# EAGLE design openmv (EAGLE 6.1)
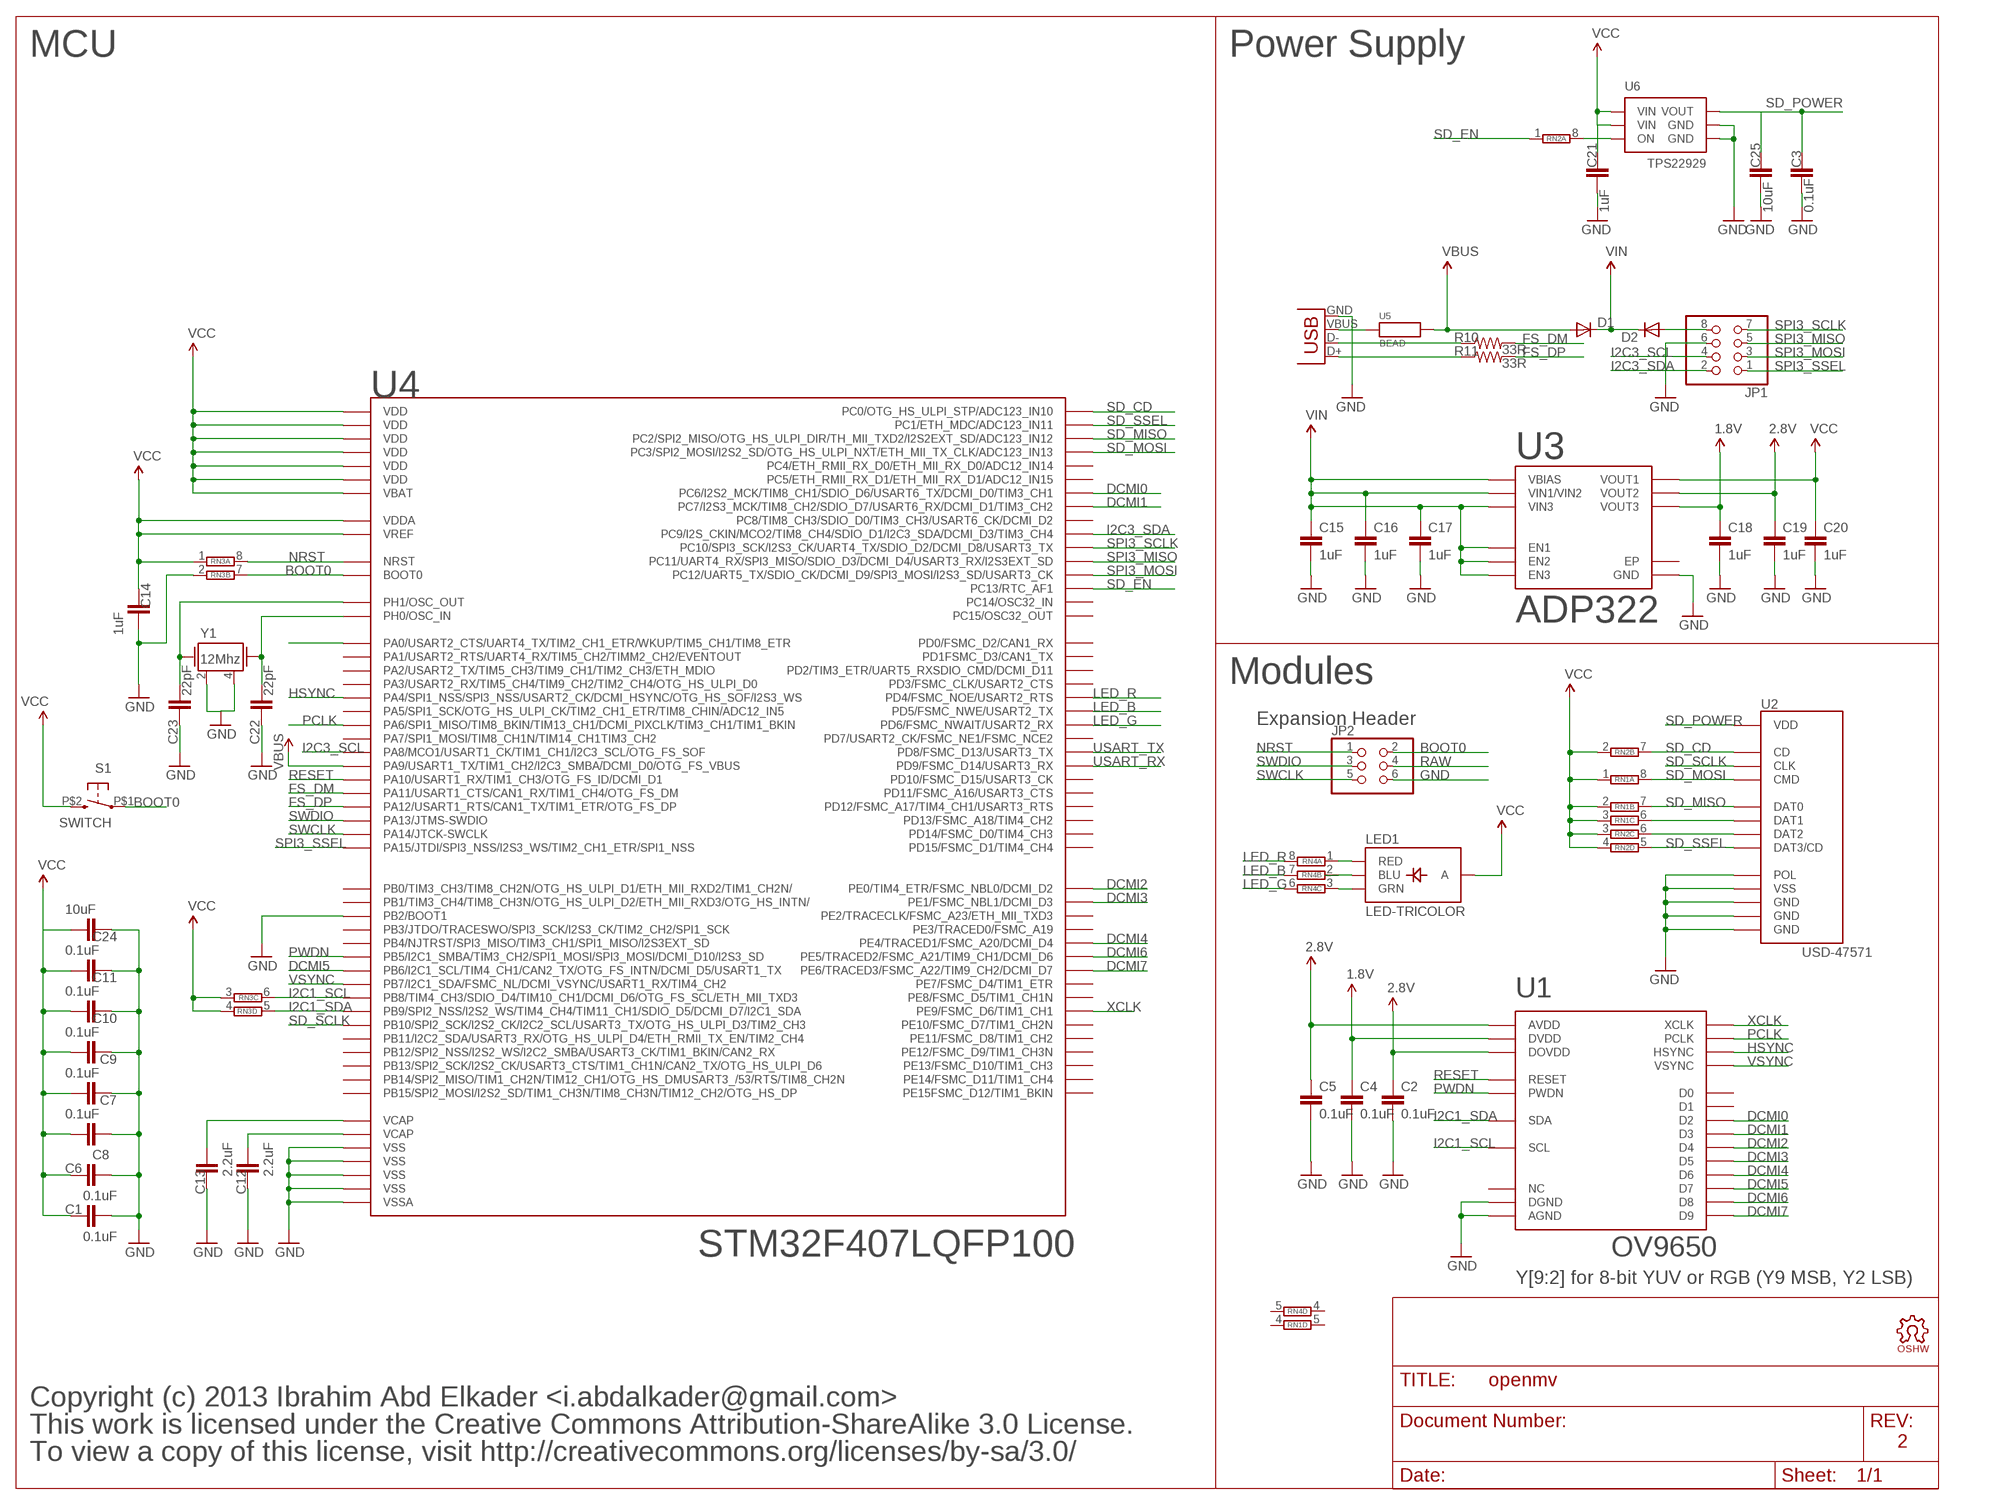
[diagram p0: schematic, sheet 1]

## Parts
C1  0.1uF  CAP0402-CAP  [0402-CAP]
C2  0.1uF  CAP0402-CAP  [0402-CAP]
C3  0.1uF  CAP0402-CAP  [0402-CAP]
C4  0.1uF  CAP0402-CAP  [0402-CAP]
C5  0.1uF  CAP0402-CAP  [0402-CAP]
C6  0.1uF  CAP0402-CAP  [0402-CAP]
C7  0.1uF  CAP0402-CAP  [0402-CAP]
C8  0.1uF  CAP0402-CAP  [0402-CAP]
C9  0.1uF  CAP0402-CAP  [0402-CAP]
C10  0.1uF  CAP0402-CAP  [0402-CAP]
C11  0.1uF  CAP0402-CAP  [0402-CAP]
C12  2.2uF  CAP0402-CAP  [0402-CAP]
C13  2.2uF  CAP0402-CAP  [0402-CAP]
C14  1uF  CAP0402-CAP  [0402-CAP]
C15  1uF  CAP0402-CAP  [0402-CAP]
C16  1uF  CAP0402-CAP  [0402-CAP]
C17  1uF  CAP0402-CAP  [0402-CAP]
C18  1uF  CAP0402-CAP  [0402-CAP]
C19  1uF  CAP0402-CAP  [0402-CAP]
C20  1uF  CAP0402-CAP  [0402-CAP]
C21  1uF  CAP0402-CAP  [0402-CAP]
C22  22pF  CAP0402-CAP  [0402-CAP]
C23  22pF  CAP0402-CAP  [0402-CAP]
C24  10uF  CAP0805  [0805]
C25  10uF  CAP0805  [0805]
D1  DIODESOD  [SOD-323]
D2  DIODESOD  [SOD-323]
JP1  PINHD-2X4  [2X04]
JP2  PINHD-2X3  [2X03]
LED1  LED-TRICOLOR  [LED-TRICOLOR-SMD]
LOGO1  OSHW_LOGO_FILLX0150-NT  [OSHW_FILLX150_NOTEXT]
R10  33R  RESISTOR0402-RES  [0402-RES]
R11  33R  RESISTOR0402-RES  [0402-RES]
RN1  4R-NCAT16  [CAT16]
RN2  4R-NCAT16  [CAT16]
RN3  4R-NCAT16  [CAT16]
RN4  4R-NCAT16  [CAT16]
S1  SWITCH  [B3U-1000P]
U1  OV9650  [OV9650]
U2  USD-47571  [USD-47571]
U3  ADP322  [WFQFN-16]
U4  STM32F407LQFP100  [LQFP100]
U5  BEAD  [0402-CAP]
U6  TPS22929  [SOT23-6]
X1  USB-MICROB  [USB-MICROB]
Y1  12Mhz  CRYSTAL5X3  [CRYSTAL-SMD-5X3]

## Nets
1.8V: C4.1 C18.1 U1.P$10(DVDD) U3.8(VOUT3)
2.8V: C2.1 C5.1 C19.1 U1.P$4(AVDD) U1.P$11(DOVDD) U3.6(VOUT2)
BOOT0: JP2.2 RN3.7 S1.P$1 U4.94(BOOT0)
DCMI0: U1.P$19(D2) U4.63(PC6/I2S2_MCK/TIM8_CH1/SDIO_D6/USART6_TX/DCMI_D0/TIM3_CH1)
DCMI1: U1.P$21(D3) U4.64(PC7/I2S3_MCK/TIM8_CH2/SDIO_D7/USART6_RX/DCMI_D1/TIM3_CH2)
DCMI2: U1.P$22(D4) U4.97(PE0/TIM4_ETR/FSMC_NBL0/DCMI_D2)
DCMI3: U1.P$20(D5) U4.98(PE1/FSMC_NBL1/DCMI_D3)
DCMI4: U1.P$18(D6) U4.3(PE4/TRACED1/FSMC_A20/DCMI_D4)
DCMI5: U1.P$16(D7) U4.92(PB6/I2C1_SCL/TIM4_CH1/CAN2_TX/OTG_FS_INTN/DCMI_D5/USART1_TX)
DCMI6: U1.P$14(D8) U4.4(PE5/TRACED2/FSMC_A21/TIM9_CH1/DCMI_D6)
DCMI7: U1.P$12(D9) U4.5(PE6/TRACED3/FSMC_A22/TIM9_CH2/DCMI_D7)
FS_DM: R10.2 U4.70(PA11/USART1_CTS/CAN1_RX/TIM1_CH4/OTG_FS_DM)
FS_DP: R11.2 U4.71(PA12/USART1_RTS/CAN1_TX/TIM1_ETR/OTG_FS_DP)
GND: C1.1 C2.2 C3.2 C4.2 C5.2 C6.1 C7.2 C8.1 C9.2 C10.2 C11.2 C12.2 C13.2 C14.1 C15.2 C16.2 C17.2 C18.2 C19.2 C20.2 C21.2 C22.2 C23.2 C24.1 C25.2 JP1.6 JP2.6 RN3.2 U1.P$2(AGND) U1.P$15(DGND) U2.G$1(GND) U2.G$2(GND) U2.G$3(GND) U2.G$4(POL) U2.P$6(VSS) U3.12(GND) U4.10(VSS) U4.20(VSSA) U4.27(VSS) U4.37(PB2/BOOT1) U4.74(VSS) U4.99(VSS) U6.2(GND) U6.5(GND) X1.GND Y1.2 Y1.4
HSYNC: U1.P$9(HSYNC) U4.29(PA4/SPI1_NSS/SPI3_NSS/USART2_CK/DCMI_HSYNC/OTG_HS_SOF/I2S3_WS)
I2C1_SCL: RN3.6 U1.P$5(SCL) U4.95(PB8/TIM4_CH3/SDIO_D4/TIM10_CH1/DCMI_D6/OTG_FS_SCL/ETH_MII_TXD3)
I2C1_SDA: RN3.5 U1.P$3(SDA) U4.96(PB9/SPI2_NSS/I2S2_WS/TIM4_CH4/TIM11_CH1/SDIO_D5/DCMI_D7/I2C1_SDA)
I2C3_SCL: JP1.4 U4.67(PA8/MCO1/USART1_CK/TIM1_CH1/I2C3_SCL/OTG_FS_SOF)
I2C3_SDA: JP1.2 U4.66(PC9/I2S_CKIN/MCO2/TIM8_CH4/SDIO_D1/I2C3_SDA/DCMI_D3/TIM3_CH4)
LED_B: RN4.7 U4.86(PD5/FSMC_NWE/USART2_TX)
LED_G: RN4.6 U4.87(PD6/FSMC_NWAIT/USART2_RX)
LED_R: RN4.8 U4.85(PD4/FSMC_NOE/USART2_RTS)
N$1: RN1.6 U2.P$8(DAT1)
N$2: RN2.6 U2.P$1(DAT2)
N$3: LED1.R(RED) RN4.1
N$4: LED1.B(BLU) RN4.2
N$5: LED1.G(GRN) RN4.3
N$6: U4.23(PA0/USART2_CTS/UART4_TX/TIM2_CH1_ETR/WKUP/TIM5_CH1/TIM8_ETR)
N$8: RN2.8 U6.3(ON)
N$9: C23.1 U4.13(PH1/OSC_OUT) Y1.1
N$10: C22.1 U4.12(PH0/OSC_IN) Y1.3
N$20: R10.1 X1.D-
N$21: R11.1 X1.D+
N$22: U5.1 X1.VBUS
NRST: JP2.1 RN3.8 U4.14(NRST)
PCLK: U1.P$17(PCLK) U4.31(PA6/SPI1_MISO/TIM8_BKIN/TIM13_CH1/DCMI_PIXCLK/TIM3_CH1/TIM1_BKIN)
PWDN: U1.P$8(PWDN) U4.91(PB5/I2C1_SMBA/TIM3_CH2/SPI1_MOSI/SPI3_MOSI/DCMI_D10/I2S3_SD)
RAW: D2.2(A) JP1.8 JP2.4
RESET: U1.P$6(RESET) U4.69(PA10/USART1_RX/TIM1_CH3/OTG_FS_ID/DCMI_D1)
SD_CD: RN2.7 U2.G$5(CD) U4.15(PC0/OTG_HS_ULPI_STP/ADC123_IN10)
SD_EN: RN2.1 U4.7(PC13/RTC_AF1)
SD_MISO: RN1.7 U2.P$7(DAT0) U4.17(PC2/SPI2_MISO/OTG_HS_ULPI_DIR/TH_MII_TXD2/I2S2EXT_SD/ADC123_IN12)
SD_MOSI: RN1.8 U2.P$3(CMD) U4.18(PC3/SPI2_MOSI/I2S2_SD/OTG_HS_ULPI_NXT/ETH_MII_TX_CLK/ADC123_IN13)
SD_POWER: C3.1 C25.1 U2.P$4(VDD) U6.1(VOUT)
SD_SCLK: U2.P$5(CLK) U4.47(PB10/SPI2_SCK/I2S2_CK/I2C2_SCL/USART3_TX/OTG_HS_ULPI_D3/TIM2_CH3)
SD_SSEL: RN2.5 U2.P$2(DAT3/CD) U4.16(PC1/ETH_MDC/ADC123_IN11)
SPI3_MISO: JP1.5 U4.79(PC11/UART4_RX/SPI3_MISO/SDIO_D3/DCMI_D4/USART3_RX/I2S3EXT_SD)
SPI3_MOSI: JP1.3 U4.80(PC12/UART5_TX/SDIO_CK/DCMI_D9/SPI3_MOSI/I2S3_SD/USART3_CK)
SPI3_SCLK: JP1.7 U4.78(PC10/SPI3_SCK/I2S3_CK/UART4_TX/SDIO_D2/DCMI_D8/USART3_TX)
SPI3_SSEL: JP1.1 U4.77(PA15/JTDI/SPI3_NSS/I2S3_WS/TIM2_CH1_ETR/SPI1_NSS)
SWCLK: JP2.5 U4.76(PA14/JTCK-SWCLK)
SWDIO: JP2.3 U4.72(PA13/JTMS-SWDIO)
USART_RX: U4.56(PD9/FSMC_D14/USART3_RX)
USART_TX: U4.55(PD8/FSMC_D13/USART3_TX)
VBUS: D1.2(A) U4.68(PA9/USART1_TX/TIM1_CH2/I2C3_SMBA/DCMI_D0/OTG_FS_VBUS) U5.2
VCAP1: C13.1 U4.49(VCAP)
VCAP2: C12.1 U4.73(VCAP)
VCC: C1.2 C6.2 C7.1 C8.2 C9.1 C10.1 C11.1 C14.2 C20.1 C21.1 C24.2 LED1.A RN1.1 RN1.2 RN1.3 RN2.2 RN2.3 RN2.4 RN3.1 RN3.3 RN3.4 S1.P$2 U3.5(VOUT1) U4.6(VBAT) U4.11(VDD) U4.19(VDD) U4.21(VREF) U4.22(VDDA) U4.28(VDD) U4.50(VDD) U4.75(VDD) U4.100(VDD) U6.4(VIN) U6.6(VIN)
VIN: C15.1 C16.1 C17.1 D1.1(C) D2.1(C) U3.1(EN1) U3.2(VBIAS) U3.3(VIN1/VIN2) U3.10(VIN3) U3.15(EN3) U3.16(EN2)
VSYNC: U1.P$7(VSYNC) U4.93(PB7/I2C1_SDA/FSMC_NL/DCMI_VSYNC/USART1_RX/TIM4_CH2)
XCLK: U1.P$13(XCLK) U4.40(PE9/FSMC_D6/TIM1_CH1)
Unconnected: RN1.4 RN1.5 RN4.4 RN4.5 U1.P$1(NC) U1.P$23(D1) U1.P$24(D0) U3.4(NC) U3.7(NC) U3.9(NC) U3.11(NC) U3.13(NC) U3.14(NC) U3.EXP(EP) U4.1(PE2/TRACECLK/FSMC_A23/ETH_MII_TXD3) U4.2(PE3/TRACED0/FSMC_A19) U4.8(PC14/OSC32_IN) U4.9(PC15/OSC32_OUT) U4.24(PA1/USART2_RTS/UART4_RX/TIM5_CH2/TIMM2_CH2/EVENTOUT) U4.25(PA2/USART2_TX/TIM5_CH3/TIM9_CH1/TIM2_CH3/ETH_MDIO) U4.26(PA3/USART2_RX/TIM5_CH4/TIM9_CH2/TIM2_CH4/OTG_HS_ULPI_D0) U4.30(PA5/SPI1_SCK/OTG_HS_ULPI_CK/TIM2_CH1_ETR/TIM8_CHIN/ADC12_IN5) U4.32(PA7/SPI1_MOSI/TIM8_CH1N/TIM14_CH1TIM3_CH2) U4.33(PC4/ETH_RMII_RX_D0/ETH_MII_RX_D0/ADC12_IN14) U4.34(PC5/ETH_RMII_RX_D1/ETH_MII_RX_D1/ADC12_IN15) U4.35(PB0/TIM3_CH3/TIM8_CH2N/OTG_HS_ULPI_D1/ETH_MII_RXD2/TIM1_CH2N/) U4.36(PB1/TIM3_CH4/TIM8_CH3N/OTG_HS_ULPI_D2/ETH_MII_RXD3/OTG_HS_INTN/) U4.38(PE7/FSMC_D4/TIM1_ETR) U4.39(PE8/FSMC_D5/TIM1_CH1N) U4.41(PE10/FSMC_D7/TIM1_CH2N) U4.42(PE11/FSMC_D8/TIM1_CH2) U4.43(PE12/FSMC_D9/TIM1_CH3N) U4.44(PE13/FSMC_D10/TIM1_CH3) U4.45(PE14/FSMC_D11/TIM1_CH4) U4.46(PE15FSMC_D12/TIM1_BKIN) U4.48(PB11/I2C2_SDA/USART3_RX/OTG_HS_ULPI_D4/ETH_RMII_TX_EN/TIM2_CH4) U4.51(PB12/SPI2_NSS/I2S2_WS/I2C2_SMBA/USART3_CK/TIM1_BKIN/CAN2_RX) U4.52(PB13/SPI2_SCK/I2S2_CK/USART3_CTS/TIM1_CH1N/CAN2_TX/OTG_HS_ULPI_D6) U4.53(PB14/SPI2_MISO/TIM1_CH2N/TIM12_CH1/OTG_HS_DMUSART3_/53/RTS/TIM8_CH2N) U4.54(PB15/SPI2_MOSI/I2S2_SD/TIM1_CH3N/TIM8_CH3N/TIM12_CH2/OTG_HS_DP) U4.57(PD10/FSMC_D15/USART3_CK) U4.58(PD11/FSMC_A16/USART3_CTS) U4.59(PD12/FSMC_A17/TIM4_CH1/USART3_RTS) U4.60(PD13/FSMC_A18/TIM4_CH2) U4.61(PD14/FSMC_D0/TIM4_CH3) U4.62(PD15/FSMC_D1/TIM4_CH4) U4.65(PC8/TIM8_CH3/SDIO_D0/TIM3_CH3/USART6_CK/DCMI_D2) U4.81(PD0/FSMC_D2/CAN1_RX) U4.82(PD1FSMC_D3/CAN1_TX) U4.83(PD2/TIM3_ETR/UART5_RXSDIO_CMD/DCMI_D11) U4.84(PD3/FSMC_CLK/USART2_CTS) U4.88(PD7/USART2_CK/FSMC_NE1/FSMC_NCE2) U4.89(PB3/JTDO/TRACESWO/SPI3_SCK/I2S3_CK/TIM2_CH2/SPI1_SCK) U4.90(PB4/NJTRST/SPI3_MISO/TIM3_CH1/SPI1_MISO/I2S3EXT_SD)

## Notes on the sheet
- MCU | Power Supply
- Modules
- Expansion Header
- Y[9:2] for 8-bit YUV or RGB (Y9 MSB, Y2 LSB)
- Copyright (c) 2013 Ibrahim Abd Elkader <i.abdalkader@gmail.com>
- This work is licensed under the Creative Commons Attribution-ShareAlike 3.0 License.
- 2
- To view a copy of this license, visit http://creativecommons.org/licenses/by-sa/3.0/

## Library data of the parts
C1-C25 = sfe:CAP: Capacitor Standard 0603 ceramic capacitor, and 0.1" leaded capacitor.
D1 D2 = sfe:DIODE: Diode These are standard reverse protection diodes and small signal diodes. SMA package can handle up to about 1A. SOD-323 can handle about 200mA. What the SOD-323 package when ordering, there are some mfgs out there that are 5-pin packages.
JP1 = pinhead:PINHD-2X4: PIN HEADER
JP2 = mux:PINHD-2X3: PIN HEADER
LED1 = sfe:LED-TRICOLOR: Tri-Color LED SMD Proven layout and schematic for triple color LED in SMD package - common anode. Spark Fun Electronics SKU : COM-07844
LOGO1 = iofault:OSHW_LOGO_FILL
R10 R11 = sfe:RESISTOR: Resistor Basic schematic elements and footprints for 0603, 1206, and PTH resistors.
RN1-RN4 = resistor-dil:4R-N: Array Chip Resistor Source: RS Component / Phycomp; OC_FARNELL: unknown; OC_NEWARK: unknown
S1 = mux:SWITCH
U1 = iofault:OV9650
U2 = mux:USD-47571
U3 = iofault:ADP322
U4 = mux:STM32F407
U5 = heka:BEAD
U6 = mux:TPS22929
X1 = sfe:USB: USB Connectors USB-B-PTH is fully proven SKU : PRT-00139 USB-miniB is fully proven SKU : PRT-00587 USB-A-PCB is untested. USB-A-H is throughly reviewed, but untested. Spark Fun Electronics SKU : PRT-00437 USB-B-SMT is throughly reviewed, but untested. Needs silkscreen touching up. USB-A-S has not been used/tested USB-MB-H has not been used/tested
Y1 = mux:CRYSTAL: Crystals Various standard crystals. Proven footprints. Spark Fun Electronics SKU : COM-00534

## Net classes
0 default: width 0.152 mm

## Board
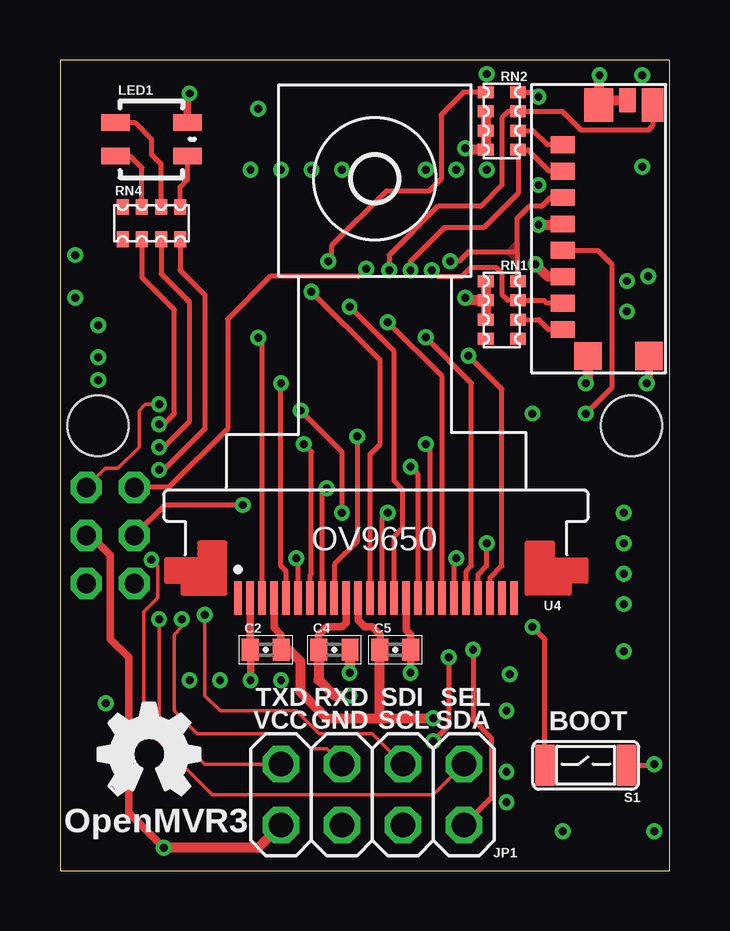
[diagram p1: board, top side]
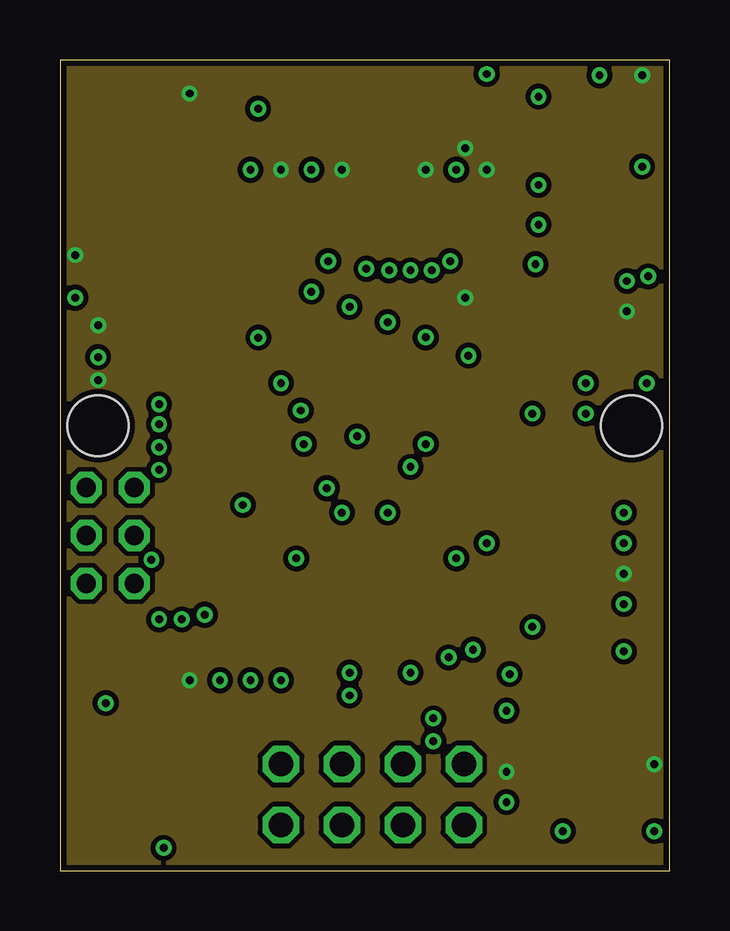
[diagram p2: board, inner layer Route2]
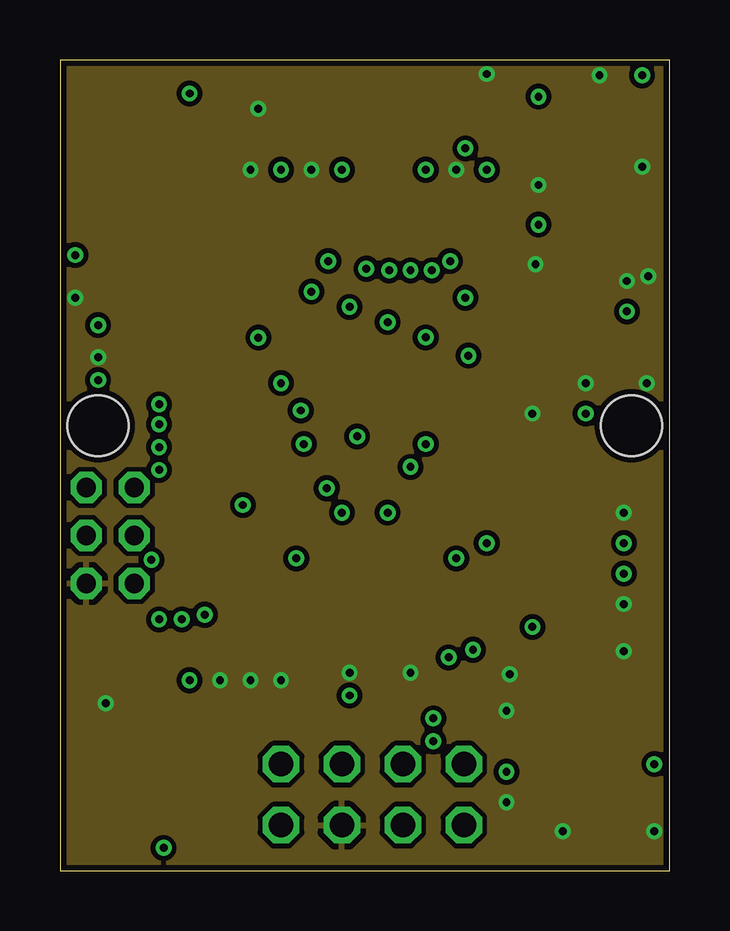
[diagram p3: board, inner layer Route15]
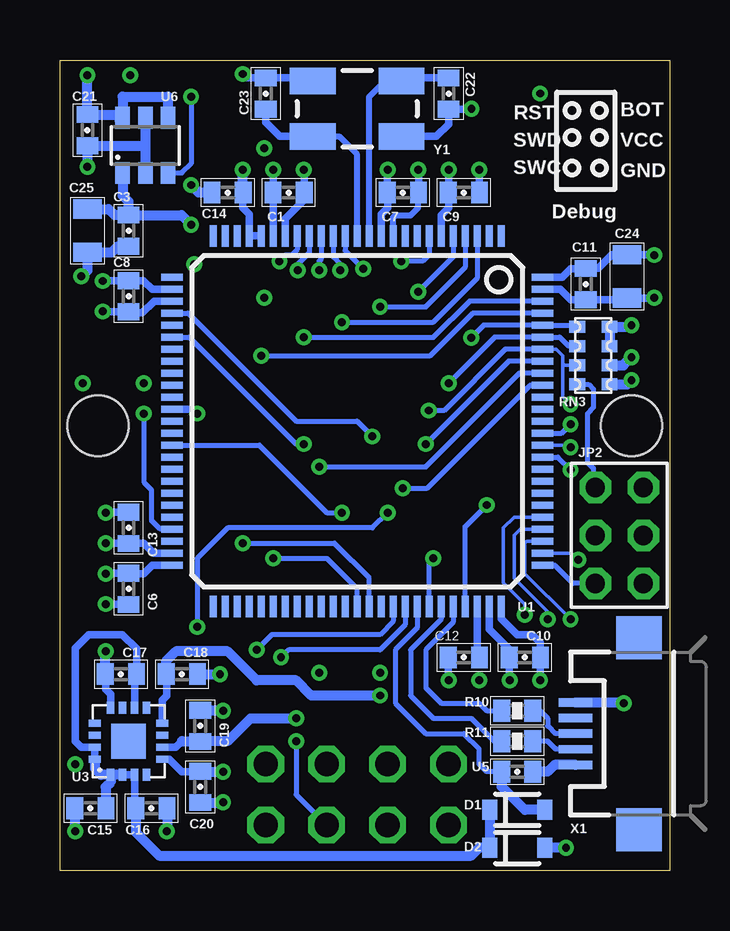
[diagram p4: board, bottom side, seen from below]

Size 25.4 x 33.78 mm. Coordinates in mm from the lower left corner, seen from the top.
Outline: 0,0 25.4,0 25.4,33.78 0,33.78 0,0
Copper layers (1*2+15*16): Top 0.035mm / dielectric 1.5mm / Route2 0.035mm / dielectric 0.15mm / Route15 0.035mm / dielectric 0.2mm / Bottom 0.035mm
Design rules: minimum track width 6mil, minimum drill 10mil, track to track 6mil, track to pad 6mil, pad to pad 6mil, via to via 6mil, smd to smd 6mil, copper to edge 10mil, drill to drill 13mil, minimum pad ring 10mil, minimum via ring 4mil, stop-mask expansion 2mil, vias tented up to drill 20mil, thermal gap 10mil
Holes 2.54 mm at 1.59,18.54 23.81,18.54

### Footprints (pad centres in the part's own frame; a part is rotated, then mirrored left to right if it is on the bottom)
0402-CAP = smd 0.7 x 0.9: 1 -0.65,0; 2 0.65,0
0805 = smd 0.8 x 1.2: 1 -0.9,0; 2 0.9,0
SOD-323 = smd 0.63 x 0.83: 1 -1.15,0; 2 1.15,0
2X04 = drill 1.016 octagon: 1 -3.81,-1.27; 2 -3.81,1.27; 3 -1.27,-1.27; 4 -1.27,1.27; 5 1.27,-1.27; 6 1.27,1.27; 7 3.81,-1.27; 8 3.81,1.27
2X03 = drill 0.8 octagon: 1 -2,-1; 2 -2,1; 3 0,-1; 4 0,1; 5 2,-1; 6 2,1
LED-TRICOLOR-SMD = smd 0.7 x 1.2: A 0.7,-1.5; B 0.7,1.5; G -0.7,1.5; R -0.7,-1.5
0402-RES = smd 0.7 x 0.9: 1 -0.65,0; 2 0.65,0
CAT16 = smd 0.5 x 0.65: 1 -1.2,-0.675; 2 -0.4,-0.675; 3 0.4,-0.675; 4 1.2,-0.675; 5 1.2,0.675; 6 0.4,0.675; 7 -0.4,0.675; 8 -1.2,0.675
B3U-1000P = smd 0.8 x 1.7: P$1 -1.7,-0.05; P$2 1.7,-0.05
OV9650 = smd 0.3 x 1.4: P$1 -5.6,-11.5; P$2 -5.1,-11.5; P$3 -4.6,-11.5; P$4 -4.1,-11.5; P$5 -3.6,-11.5; P$6 -3.1,-11.5; P$7 -2.6,-11.5; P$8 -2.1,-11.5; P$9 -1.6,-11.5; P$10 -1.1,-11.5; P$11 -0.6,-11.5; P$12 -0.1,-11.5; P$13 0.4,-11.5; P$14 0.9,-11.5; P$15 1.4,-11.5; P$16 1.9,-11.5; P$17 2.4,-11.5; P$18 2.9,-11.5; P$19 3.4,-11.5; P$20 3.9,-11.5; P$21 4.4,-11.5; P$22 4.9,-11.5; P$23 5.4,-11.5; P$24 5.9,-11.5
USD-47571 = smd 1.15 x 1.15: G$1 -4.9,0.55 | smd 1.2 x 1.15: G$2 -4.9,-2 | smd 1.4 x 1.2: G$3 5.55,0.1 | smd 1 x 0.7: G$4 5.75,-1.1 | smd 1.4 x 0.9: G$5 5.55,-2.15 | smd 0.7 x 1: P$1 3.9,1.6; P$2 2.8,1.6; P$3 1.7,1.6; P$4 0.6,1.6; P$5 -0.5,1.6; P$6 -1.6,1.6; P$7 -2.7,1.6; P$8 -3.8,1.6
WFQFN-16 = smd 0.5 x 0.3: 1 -1.4,0.75; 2 -1.4,0.25; 3 -1.4,-0.25; 4 -1.4,-0.75; 9 1.4,-0.75; 10 1.4,-0.25; 11 1.4,0.25; 12 1.4,0.75 | smd 0.3 x 0.5: 5 -0.75,-1.4; 6 -0.25,-1.4; 7 0.25,-1.4; 8 0.75,-1.4; 13 0.75,1.4; 14 0.25,1.4; 15 -0.25,1.4; 16 -0.75,1.4 | smd 1.45 x 1.45: EXP 0,0
LQFP100 = smd 0.9 x 0.3: 1 -7.72,6; 2 -7.72,5.5; 3 -7.72,5; 4 -7.72,4.5; 5 -7.72,4; 6 -7.72,3.5; 7 -7.72,3; 8 -7.72,2.5; 9 -7.72,2; 10 -7.72,1.5; 11 -7.72,1; 12 -7.72,0.5; 13 -7.72,0; 14 -7.72,-0.5; 15 -7.72,-1; 16 -7.72,-1.5; 17 -7.72,-2; 18 -7.72,-2.5; 19 -7.72,-3; 20 -7.72,-3.5; 21 -7.72,-4; 22 -7.72,-4.5; 23 -7.72,-5; 24 -7.72,-5.5; 25 -7.72,-6; 51 7.72,-6; 52 7.72,-5.5; 53 7.72,-5; 54 7.72,-4.5; 55 7.72,-4; 56 7.72,-3.5; 57 7.72,-3; 58 7.72,-2.5; 59 7.72,-2; 60 7.72,-1.5; 61 7.72,-1; 62 7.72,-0.5; 63 7.72,0; 64 7.72,0.5; 65 7.72,1; 66 7.72,1.5; 67 7.72,2; 68 7.72,2.5; 69 7.72,3; 70 7.72,3.5; 71 7.72,4; 72 7.72,4.5; 73 7.72,5; 74 7.72,5.5; 75 7.72,6 | smd 0.3 x 0.9: 26 -6,-7.72; 27 -5.5,-7.72; 28 -5,-7.72; 29 -4.5,-7.72; 30 -4,-7.72; 31 -3.5,-7.72; 32 -3,-7.72; 33 -2.5,-7.72; 34 -2,-7.72; 35 -1.5,-7.72; 36 -1,-7.72; 37 -0.5,-7.72; 38 0,-7.72; 39 0.5,-7.72; 40 1,-7.72; 41 1.5,-7.72; 42 2,-7.72; 43 2.5,-7.72; 44 3,-7.72; 45 3.5,-7.72; 46 4,-7.72; 47 4.5,-7.72; 48 5,-7.72; 49 5.5,-7.72; 50 6,-7.72; 76 6,7.72; 77 5.5,7.72; 78 5,7.72; 79 4.5,7.72; 80 4,7.72; 81 3.5,7.72; 82 3,7.72; 83 2.5,7.72; 84 2,7.72; 85 1.5,7.72; 86 1,7.72; 87 0.5,7.72; 88 0,7.72; 89 -0.5,7.72; 90 -1,7.72; 91 -1.5,7.72; 92 -2,7.72; 93 -2.5,7.72; 94 -3,7.72; 95 -3.5,7.72; 96 -4,7.72; 97 -4.5,7.72; 98 -5,7.72; 99 -5.5,7.72; 100 -6,7.72
SOT23-6 = smd 0.6 x 0.9: 1 -0.95,-1.15; 2 0,-1.15; 3 0.95,-1.15; 4 0.95,1.15; 5 0,1.15; 6 -0.95,1.15
USB-MICROB = smd 0.35 x 1.4: D+ 0,2.65; D- -0.65,2.65; GND 1.3,2.65; ID 0.65,2.65; VBUS -1.3,2.65 | smd 1.8 x 1.9: MT1 -4,0; MT2 4,0
CRYSTAL-SMD-5X3 = smd 1.9 x 1.1: 1 -1.85,-1.15; 2 1.85,-1.15; 3 1.85,1.15; 4 -1.85,1.15

### Placement (x,y rotation side)
C1  15.88,28.26 0 bottom
C2  8.57,9.21 180 top
C3  22.54,26.67 270 bottom
C4  11.43,9.21 0 top
C5  13.97,9.21 0 top
C6  22.54,11.75 90 bottom
C7  11.11,28.26 0 bottom
C8  22.54,23.94 270 bottom
C9  8.57,28.26 0 bottom
C10  6.03,8.89 180 bottom
C11  3.49,24.45 270 bottom
C12  8.57,8.89 180 bottom
C13  22.54,14.29 90 bottom
C14  18.41,28.26 0 bottom
C15  24.13,2.6 180 bottom
C16  21.59,2.6 0 bottom
C17  22.86,8.19 180 bottom
C18  20.32,8.19 0 bottom
C19  19.56,6.03 90 bottom
C20  19.56,3.49 270 bottom
C21  24.26,30.86 270 bottom
C22  9.21,32.38 270 bottom
C23  16.83,32.38 90 bottom
C24  1.78,24.77 90 bottom
C25  24.26,26.67 270 bottom
D1  6.35,2.54 0 bottom
D2  6.35,0.95 0 bottom
JP1  13.02,3.17 180 top
JP2  2.1,13.97 270 bottom
LED1  3.81,30.48 90 top
LOGO1  1.59,3.17 0 top
R10  6.35,5.4 180 bottom
R11  6.35,6.67 180 bottom
RN1  18.41,23.37 270 top
RN2  18.41,31.24 270 top
RN3  3.17,21.46 90 bottom
RN4  3.81,26.99 180 top
S1  21.91,4.45 0 top
U1  13.02,22.86 0 top
U2  22.54,26.35 90 top
U3  22.54,5.4 90 bottom
U4  13.02,18.73 270 bottom
U5  6.35,4.13 180 bottom
U6  21.84,30.23 0 bottom
X1  1.27,5.71 90 bottom
Y1  13.02,31.75 0 bottom

### Tracks (layer width: path | path; a pad name or v marks a point on that pad's centre or on a via)
1.8V  (via drill 0.33)
  Top 0.305: U1.P$10 11.92,10.33 11.75,10.16 11.11,10.16 10.78,9.83 10.78,8.64
  Top 0.406: C4.1 10.78,8.64 10.78,7.95 11.43,7.3 v12.06,7.3
  Bottom 0.305: U3.8 21.14,7.12 20.95,7.3 20.95,8.18 C18.1
  Bottom 0.406: C18.1 20.97,8.75 20.57,9.14 18.41,9.14 17.21,7.94 15.56,7.94 14.92,7.3 v12.06,7.3
2.8V  (via drill 0.33)
  Top 0.305: U1.P$4 8.92,10.13 9.21,9.84 9.21,9.22 | U1.P$11 12.42,10.44 12.7,10.16 13.02,10.16 13.34,9.84 13.34,9.22 C5.1
  Top 0.406: 9.21,9.22 C2.1 9.53,9.21 10,8.73 10,7.46 11.11,6.35 13.34,6.35 | 13.34,6.35 v15.56,6.35 | 13.34,6.35 13.32,6.37 C5.1
  Bottom 0.305: U3.6 20.57,5.15 20.32,5.4
  Bottom 0.406: v15.56,6.35 17.46,6.35 18.41,5.4 19.54,5.4 C19.1 19.57,5.4 20.32,5.4
BOOT0  (via drill 0.33)
  Top 0.152: v4.13,19.43 3.56,19.43 3.3,19.18 3.3,17.65 2.41,16.76 1.89,16.76 JP2.2
  Top 0.203: v10.03,19.18 11.75,17.46 v11.75,14.92 | S1.P$1 20.21,9.64 v19.68,10.16
  Bottom 0.152: U4.94 4.71,21.73 4.45,21.46 4.45,21.14 | RN3.7 4.36,21.06 4.45,21.14 | 4.45,21.14 4.45,19.75 v4.13,19.43
  Bottom 0.203: U4.94 6.84,21.73 9.4,19.18 v10.03,19.18 | v11.75,14.92 12.38,14.29 18.41,14.29 19.68,13.02 v19.68,10.16
DCMI0  (via drill 0.33)
  Top 0.203: U1.P$19 16.42,12.93 v16.51,13.02
  Bottom 0.203: v16.51,13.02 14.29,13.02 13.02,11.75 U4.63
DCMI1  (via drill 0.33)
  Top 0.203: U1.P$21 17.42,12.34 17.78,12.7 v17.78,13.65
  Bottom 0.203: v17.78,13.65 13.97,13.65 12.52,12.2 U4.64
DCMI2  (via drill 0.33)
  Top 0.203: v17.02,21.46 18.41,20.07 18.41,12.7 17.92,12.2 U1.P$22
  Bottom 0.203: v17.02,21.46 9.97,21.46 8.2,23.23 U4.97
DCMI3  (via drill 0.33)
  Top 0.203: v15.24,22.23 17.14,20.32 17.14,12.7 16.92,12.47 U1.P$20
  Bottom 0.203: v15.24,22.23 9.84,22.23 8.34,23.73 U4.98
DCMI4  (via drill 0.33)
  Top 0.203: v13.65,22.86 15.92,20.59 U1.P$18
  Bottom 0.203: v13.65,22.86 9.84,22.86 8.02,24.68 U4.3
DCMI5  (via drill 0.33)
  Top 0.203: v14.61,16.83 14.92,16.52 U1.P$16
  Bottom 0.203: v14.61,16.83 10.16,16.83 6.25,20.73 U4.92
DCMI6  (via drill 0.33)
  Top 0.203: v12.06,23.5 13.92,21.64 13.92,16.25 14.29,15.88 14.29,14.29 13.92,13.92 U1.P$14
  Bottom 0.203: v12.06,23.5 10.16,23.5 8.52,25.14 U4.4
DCMI7  (via drill 0.33)
  Top 0.203: v10.48,24.13 13.34,21.27 13.34,17.78 12.92,17.36 U1.P$12
  Bottom 0.203: U4.5 9.02,25.59 v10.48,24.13
FS_DM
  Bottom 0.203: U4.70 9.52,10.48 10.79,9.21 10.79,7.3 9.84,6.35 8.26,6.35 7.3,5.4 R10.2
FS_DP
  Bottom 0.203: U4.71 9.02,10.35 10.16,9.21 10.16,7.62 9.53,6.99 7.94,6.99 7.62,6.67 R11.2
GND  (via drill 0.33)
  Top 0.305: C2.2 7.94,9.22 7.94,9.21 | U1.P$2 7.92,9.23 7.94,9.21 | U1.P$15 14.42,10.03 14.61,9.84 14.61,9.22 | 14.61,9.22 C5.2 | 14.61,9.22 v14.61,8.26 | 7.94,9.21 v7.94,7.94 | U2.G$2 24.54,20.41 v24.45,20.32
  Top 0.406: C4.2 12.08,8.27 v12.06,8.26 | U2.G$1 21.99,20.41 v21.91,20.32 | U2.G$4 22.44,32.1 U2.G$3 22.48,31.9 v22.48,33.15 | U2.P$6 20.33,24.75 v19.81,25.27
  Bottom 0.254: U4.10 11.52,27.22 11.43,27.3 10.79,27.3 10.48,27.62 10.48,28.24 C7.2
  Bottom 0.305: C6.1 23.48,11.1 v23.5,11.11 | C13.2 23.48,14.94 v23.5,14.92 | v6.67,7.94 6.68,7.95 C10.2 6.67,8.9 6.67,9.21 7.52,10.06 U4.74 | C7.2 10.46,29.2 v10.48,29.21 | C9.2 7.92,29.2 v7.94,29.21 | v16.51,29.21 16.52,29.2 C1.1 U4.20 | U4.37 19.87,19.23 v19.68,19.05 | v8.26,31.75 8.27,31.73 C22.2 9.21,31.11 9.72,30.6 Y1.2 | U3.12 23.29,7.35 23.5,7.56 23.5,8.18 C17.2 | C12.2 9.22,7.95 v9.21,7.94 | U4.27 21.57,24.23 21.92,24.59 C8.1 23.61,24.59 v23.62,24.57 | Y1.4 15,33.03 C23.2 17.62,33.03 v17.78,33.2 | U4.99 4.55,24.23 4.11,23.8 C11.2 1.84,23.8 C24.1 0.65,23.86 v0.64,23.88
  Bottom 0.406: C15.2 24.78,1.67 v24.77,1.65 | C16.2 20.94,1.67 v20.95,1.65 | C19.2 18.62,6.68 v18.61,6.67 | C17.2 23.51,9.13 v23.5,9.14 | C18.2 v18.73,8.19 | RN3.2 1.92,21.06 v1.59,21.4 | C20.2 18.62,2.84 v18.61,2.86 | X1.GND 1.94,7.01 v1.91,6.99 | C14.1 19.62,28.26 v19.94,28.57 | U6.5 21.84,30.23 | 21.84,30.23 U6.2 | C3.2 23,26.02 23.25,25.77 C25.2 24.26,25.02 v24.51,24.77 | v24.26,29.34 C21.2 21.86,30.21 21.84,30.23
  pour Route15 (isolate 0.203): 0,0 0,33.78 25.4,33.78 25.4,0
HSYNC  (via drill 0.33)
  Top 0.203: v12.38,18.1 12.38,13.72 11.43,12.76 11.43,11.37 U1.P$9
  Bottom 0.203: U4.29 20.06,23.23 15.56,18.73 13.02,18.73 v12.38,18.1
I2C1_SCL  (via drill 0.33)
  Top 0.203: U1.P$5 9.42,12.49 9.21,12.7 v9.21,20.32
  Bottom 0.203: v9.21,20.32 7.29,22.23 U4.95 4.58,22.23 4.21,21.86 RN3.6
I2C1_SDA  (via drill 0.33)
  Top 0.203: U1.P$3 8.42,22.06 v8.27,22.21
  Bottom 0.203: v8.27,22.21 7.75,22.73 U4.96 3.92,22.73 RN3.5
I2C3_SCL  (via drill 0.33)
  Top 0.203: v15.56,5.4 16.19,6.03 v16.19,8.89
  Bottom 0.203: U4.67 11.02,10.26 12.06,9.21 15.88,9.21 v16.19,8.89 | v15.56,5.4 15.56,3.17 JP1.4
I2C3_SDA  (via drill 0.33)
  Top 0.203: v17.21,9.21 17.21,6.29 17.97,5.52 17.97,3.05 JP1.2
  Bottom 0.203: U4.66 11.52,10.39 12.06,9.84 16.57,9.84 v17.21,9.21
LED_B  (via drill 0.33)
  Top 0.203: RN4.7 4.21,24.87 5.4,23.69 5.4,18.73 4.32,17.65 v4.13,17.65
  Bottom 0.152: U4.86 4.21,17.73 v4.13,17.65
LED_G  (via drill 0.33)
  Top 0.203: RN4.6 3.41,24.72 4.76,23.37 4.76,19.05 4.32,18.61 v4.13,18.61
  Bottom 0.203: U4.87 4.5,18.23 v4.13,18.61
LED_R  (via drill 0.33)
  Top 0.203: RN4.8 5.01,25.03 6.03,24 6.03,18.41 4.32,16.7 v4.13,16.7
  Bottom 0.203: U4.85 4.66,17.23 v4.13,16.7
N$1
  Top 0.203: U2.P$8 20.37,22.55 19.96,22.97 RN1.6
N$2
  Top 0.203: U2.P$1 20.29,30.25 19.7,30.84 RN2.6
N$3
  Top 0.203: LED1.R 5.31,28.8 5.01,28.5 RN4.1
N$4
  Top 0.203: LED1.B 3.11,31.18 3.81,30.48 3.81,29.84 4.21,29.45 RN4.2
N$5
  Top 0.203: LED1.G 2.92,29.78 3.41,29.29 RN4.3
N$8  (via drill 0.33)
  Top 0.203: v19.94,32.26 19.75,32.44 RN2.8
  Bottom 0.203: U6.3 20.33,29.08 19.94,29.46 v19.94,32.26
N$9
  Bottom 0.254: U4.13 13.02,29.84 13.77,30.6 Y1.1
  Bottom 0.305: Y1.1 16.25,30.6 16.83,31.18 C23.1
N$10
  Bottom 0.254: Y1.3 11.87,32.9 12.52,32.25 U4.12
  Bottom 0.305: C22.1 11.03,33.03 Y1.3
N$20
  Bottom 0.203: X1.D- 4.75,5.07 5.08,5.4 R10.1
N$21
  Bottom 0.203: R11.1 5.4,6.67 5.08,6.35 5.08,6.03 4.76,5.71 X1.D+
N$22
  Bottom 0.406: X1.VBUS 4.79,4.42 5.08,4.13 U5.1
NRST  (via drill 0.33)
  Top 0.203: v12.76,25.08 12.45,24.77 8.76,24.77 6.99,22.99 6.99,18.41 4.54,15.97 JP2.1
  Bottom 0.203: U4.14 13.52,25.84 v12.76,25.08 | RN3.8 3.37,20.26 3.17,20.07 3.17,19.3 3.43,19.05 3.43,17.02 3.17,16.76 3.17,16.05 JP2.1
PCLK  (via drill 0.33)
  Top 0.203: U1.P$17 15.42,17.6 v15.24,17.78
  Bottom 0.203: v15.24,17.78 15.56,17.78 20.01,22.23 U4.31
PWDN  (via drill 0.33)
  Top 0.203: U1.P$8 10.92,15.74 v11.11,15.94
  Bottom 0.203: v11.11,15.94 10.1,15.94 5.8,20.23 U4.91
RAW  (via drill 0.33)
  Top 0.305: JP2.4 1.27,13.97 2.1,13.14 2.1,9.65 2.86,8.89 2.86,2.41 v4.32,0.95
  Top 0.406: v4.32,0.95 8.26,0.95 JP1.8
  Bottom 0.406: v4.32,0.95 D2.2
RESET  (via drill 0.33)
  Top 0.203: U1.P$6 9.92,12.94 v9.84,13.02
  Bottom 0.203: U4.69 10.02,12.84 v9.84,13.02
SD_CD  (via drill 0.33)
  Top 0.203: U2.G$5 24.69,31.04 24.51,30.86 21.72,30.86 20.94,31.64 RN2.7 18.69,31.64 18.41,31.37 18.41,28.57 17.53,27.69 15.75,27.69 13.72,25.65 v13.72,25.02
  Bottom 0.203: U4.15 14.02,25.57 13.72,25.27 v13.72,25.02
SD_EN  (via drill 0.33)
  Top 0.203: RN2.1 16.82,32.44 15.88,31.5 15.88,28.83 15.37,28.32 13.59,28.32 11.3,26.04 11.3,25.53 v11.18,25.4
  Bottom 0.203: U4.7 10.02,25.67 10.29,25.4 v11.18,25.4
SD_MISO  (via drill 0.33)
  Top 0.203: v15.49,25.02 15.75,24.77 16.76,24.77 17.14,25.15 18.16,25.15 18.41,24.89 18.41,24 18.65,23.77 RN1.7 20.17,23.77 20.29,23.65 U2.P$7
  Bottom 0.203: U4.17 15.02,25.75 15.49,25.27 v15.49,25.02
SD_MOSI  (via drill 0.33)
  Top 0.203: 19.05,25.78 17.02,25.78 16.64,25.4 v16.26,25.4 | 19.05,25.78 19.05,27.18 19.56,27.69 20.07,27.69 20.43,28.05 U2.P$3 | 19.05,25.78 19.05,24.53 RN1.8
  Bottom 0.203: U4.18 15.52,25.88 15.75,25.65 16,25.65 v16.26,25.4
  pour Top: 19.05,26.16 19.05,25.4 18.67,25.78
SD_POWER  (via drill 0.33)
  Top 0.406: v19.94,26.92 20.91,26.92 U2.P$4
  Bottom 0.406: C3.1 20.34,27.32 v19.94,26.92 | C25.1 23.38,27.57 23.13,27.32 C3.1 | U6.1 22.79,28.13 22.54,27.88 C3.1
SD_SCLK  (via drill 0.33)
  Top 0.203: U2.P$5 22.41,25.85 22.99,25.27 22.99,20.13 v21.91,19.05
  Bottom 0.203: v21.91,19.05 21.91,16.19 21.59,15.88 21.59,14.61 21.22,14.23 U4.47
SD_SSEL  (via drill 0.33)
  Top 0.203: 20.89,29.21 U2.P$2 20.38,29.15 19.49,30.04 RN2.5 19.09,28.23 17.65,26.8 16,26.8 14.61,25.4 v14.61,25.02
  Bottom 0.203: U4.16 14.52,25.49 14.61,25.4 v14.61,25.02
SPI3_MISO  (via drill 0.33)
  Top 0.152: v5.08,10.48 5.08,10.16 4.76,9.84 4.76,6.67 5.71,5.71 9.84,5.71 10.48,5.08 11.11,5.08 JP1.5
  Bottom 0.152: U4.79 6.21,14.23 6.48,13.97 6.48,12.19 5.08,10.79 v5.08,10.48
SPI3_MOSI  (via drill 0.33)
  Top 0.152: v6.03,10.67 6.03,7.3 6.67,6.67 9.84,6.67 10.79,5.71 13.02,5.71 JP1.3
  Bottom 0.152: U4.80 6.48,14.73 6.92,14.29 6.92,12 6.03,11.11 v6.03,10.67
SPI3_SCLK  (via drill 0.33)
  Top 0.152: v4.13,10.48 4.13,6.35 6.03,4.45 JP1.7
  Bottom 0.152: U4.78 5.95,13.73 6.03,13.65 6.03,12.38 v4.13,10.48
SPI3_SSEL  (via drill 0.33)
  Top 0.152: JP1.1 15.56,3.17 6.35,3.17 3.49,6.03 3.49,10.79 3.71,11.02 3.97,11.27 4.06,11.37 4.06,12.7 v3.81,12.95
  Bottom 0.152: v3.81,12.95 4.09,13.23 U4.77
SWCLK
  Bottom 0.203: U4.76 4.79,12.73 4.03,11.97 JP2.5
SWDIO  (via drill 0.33)
  Top 0.203: v7.62,15.24 4.37,15.24 JP2.3
  Bottom 0.203: U4.72 8.52,14.34 v7.62,15.24
VBUS
  Bottom 0.203: U4.68 10.52,10.12 11.43,9.21 11.43,6.99 10.16,5.71 8.57,5.71 7.94,5.08 7.94,4.45 7.62,4.13 U5.2
  Bottom 0.406: U5.2 7,3.51 6.03,2.54 D1.2
VCAP1  (via drill 0.33)
  Bottom 0.305: v23.5,13.65 23.48,13.64 C13.1 22.53,13.65 21.91,13.65 21.49,13.23 U4.49
VCAP2
  Bottom 0.305: U4.73 8.02,8.98 C12.1
VCC  (via drill 0.33)
  Top 0.203: S1.P$2 24.71,4.39 v24.77,4.45
  Top 0.305: LED1.A 5.31,32.3 v5.4,32.38
  Top 0.406: RN1.1 RN1.2 | RN2.2 RN2.3 RN2.4 16.95,30.04 v16.89,30.1 | RN1.2 RN1.3 | RN1.2 17,23.77 v16.89,23.88
  Bottom 0.305: C14.2 17.78,28.24 17.78,27.62 17.52,27.36 U4.22 U4.21 | 9.21,28.24 C9.1 | v23.5,12.38 23.48,12.4 C6.2 22.53,12.38 21.91,12.38 21.56,12.73 U4.50 | v11.75,29.21 11.76,29.2 C7.1 11.75,28.24 11.75,27.62 12.02,27.35 U4.11 | 9.21,28.24 v9.21,29.21 | 9.21,28.24 9.21,27.62 9.52,27.31 U4.6 | v15.24,29.21 15.22,29.2 C1.2 15.24,28.24 15.24,27.94 16.02,27.16 U4.19 | U3.5 20.84,4.65 20.32,4.13 19.57,4.13 C20.1 | U4.75 7.02,10.51 6.35,9.84 5.71,9.84 5.38,9.51 C10.1 5.38,7.95 v5.4,7.94 | U4.100 4.48,24.73 4.13,25.08 3.51,25.08 C11.1 2.97,25.1 2.4,25.66 C24.2 0.65,25.66 v0.64,25.65 | U4.28 21.48,23.73 21.97,23.24 22.49,23.24 C8.2 23.61,23.29 v23.62,23.3
  Bottom 0.406: v1.59,22.73 1.66,22.66 RN3.4 RN3.3 | 19.57,4.13 v18.61,4.13 | C14.2 v17.78,29.21 | U6.6 22.79,31.43 | U6.4 20.89,32.26 22.79,32.26 22.79,31.43 | 22.79,31.43 22.86,31.37 | 22.92,31.25 U6.6 | RN3.1 1.77,20.26 v1.59,20.45 | v24.26,33.15 C21.1 22.93,31.51 U6.6
  pour Route2 (isolate 0.203): 0,0 0,33.78 25.4,33.78 25.4,0
VIN
  Bottom 0.305: U3.16 U3.15 24.52,5.15 24.77,5.4 24.77,9.27 24.19,9.84 22.8,9.84 22.21,9.26 C17.1 22.29,8.11 U3.10 | C16.1 22.29,2.66 U3.3 U3.2
  Bottom 0.406: U3.1 23.29,3.69 23.5,3.49 23.5,2.62 C15.1 | U3.1 23.68,4 23.94,4.26 U3.16 | C16.1 22.24,1.6 21.27,0.64 8.26,0.64 7.94,0.95 D2.1 D1.1 | U3.2 U3.1
VSYNC  (via drill 0.33)
  Top 0.203: U1.P$7 10.42,12.32 10.48,12.38 10.48,17.46 v10.16,17.78
  Bottom 0.203: v10.16,17.78 6.71,21.23 U4.93
XCLK  (via drill 0.33)
  Top 0.203: U1.P$13 13.42,14.69 v13.65,14.92
  Bottom 0.203: U4.40 17.1,17.73 14.29,14.92 v13.65,14.92

### Text on the board
tPlace: TXD | RXD | SDI | SEL | VCC | GND | SCL | SDA | BOOT | OpenMV | R3
bPlace: BOT | RST | VCC | SWD | GND | SWC | Debug